# Altium project P9XV1.0.PrjPCB (part 2 of 2)
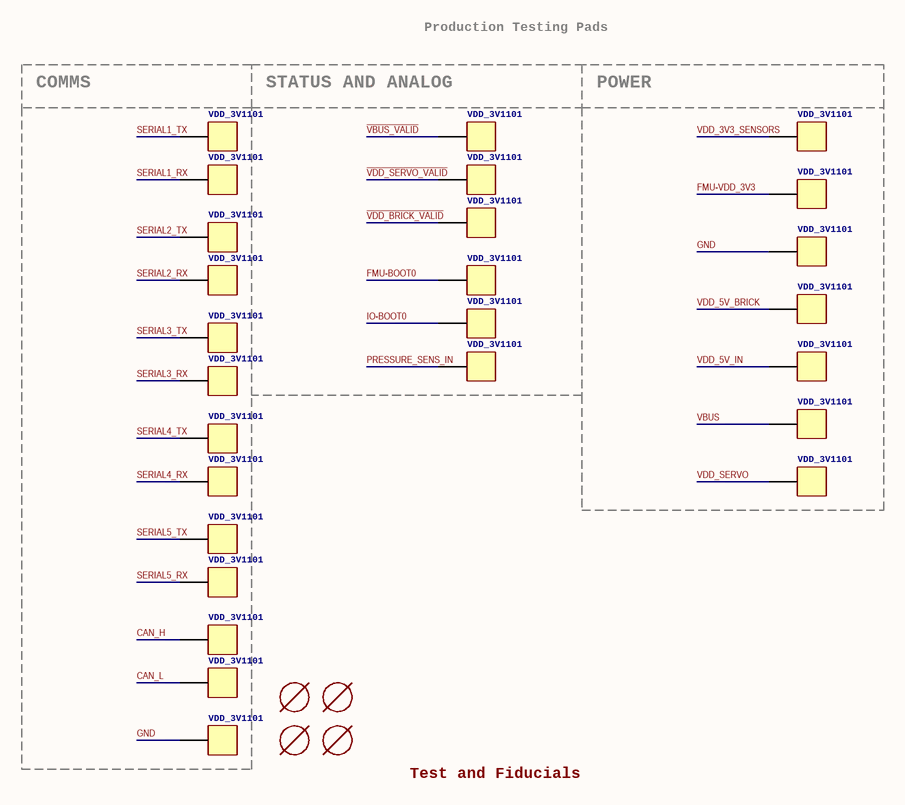
[diagram p10: Test and Fiducials.SchDoc]

## Nets that join several sheets
GND: F217Soc (24 pins), FMU IO ports (29 pins), IMU (J501.7 J501.14 U501.7 U501.8), F427&IMU Power Supply (19 pins), LEDs etc (11 pins), F100SoC (15 pins), Servo interface (24 pins), IO Power Supply (9 pins), Power SUM (20 pins), Test and Fiducials (GND.P$1 GND..P$1)
~{ACCEL_MAG_CS}: F217Soc (U101.9), IMU (J501.2 U501.2)
ACCEL_DRDY: F217Soc (U101.90), IMU (J501.4 U501.4)
ALARM: F217Soc (U101.77), LEDs etc (C705.P$2 Q701.2 R706.P$2)
~{BARO_CS}: F217Soc (U101.88), IMU (J501.10 U501.11)
BATT_CURRENT_SENS: F217Soc (U101.26), Power SUM (R1101.P$1)
BATT_VOLTAGE_SENS: F217Soc (U101.25), Power SUM (R1102.P$1)
CAN1_RX: F217Soc (U101.81), FMU IO ports (U401.4)
CAN1_TX: F217Soc (U101.82), FMU IO ports (U401.1)
CAN2_RX: F217Soc (U101.51), FMU IO ports (R216.1)
CAN2_TX: F217Soc (U101.92), FMU IO ports (R215.1)
CAN_H: FMU IO ports (J405.2 R409.P$1 U401.7), Test and Fiducials (CAN_H.P$1)
CAN_L: FMU IO ports (J405.3 R409.P$2 U401.6), Test and Fiducials (CAN_L.P$1)
~{FMU-LED_AMBER}: F217Soc (U101.43), LEDs etc (R707.P$1)
FMU-BOOT0: F217Soc (R611.1 U101.94), Test and Fiducials (FMU-BOOT1101.P$1)
FMU-CH1: F217Soc (U101.45), Servo interface (U901.7)
FMU-CH2: F217Soc (U101.44), Servo interface (U901.6)
FMU-CH3: F217Soc (U101.42), Servo interface (U901.5)
FMU-CH4: F217Soc (U101.40), Servo interface (U901.4)
FMU-CH5: F217Soc (U101.60), Servo interface (U901.3)
FMU-CH6: F217Soc (U101.61), Servo interface (U901.2)
FMU-I2C1_SCL: F217Soc (U101.95), FMU IO ports (R401.P$1 R404.P$1)
FMU-I2C1_SDA: F217Soc (U101.96), FMU IO ports (R402.P$1 R405.P$1)
FMU-I2C2_SCL: F217Soc (U101.47), FMU IO ports (R306.P$1), LEDs etc (U701.3)
FMU-I2C2_SDA: F217Soc (U101.48), FMU IO ports (R307.P$1), LEDs etc (U701.2)
FMU-~{RESET}: F427&IMU Power Supply (U603.1), LEDs etc (U701.4)
FMU-SWCLK: F217Soc (U101.76), FMU IO ports (JX301.3)
FMU-SWDIO: F217Soc (U101.72), FMU IO ports (JX301.2)
FMU-SWO: F217Soc (U101.89), FMU IO ports (JX301.4)
FMU-UART4_RX: F217Soc (U101.24), FMU IO ports (U202.16)
FMU-UART4_TX: F217Soc (U101.23), FMU IO ports (U202.5)
FMU-UART7_RX: F217Soc (U101.38), FMU IO ports (U202.14)
FMU-UART7_TX: F217Soc (U101.39), FMU IO ports (U202.7)
FMU-UART8_RX: F217Soc (U101.97), FMU IO ports (U202.12)
FMU-UART8_TX: F217Soc (U101.98), FMU IO ports (U202.9)
FMU-USART2_CTS: F217Soc (U101.84), FMU IO ports (U201.7)
FMU-USART2_RTS: F217Soc (U101.85), FMU IO ports (U201.6)
FMU-USART2_RX: F217Soc (U101.87), FMU IO ports (U201.12)
FMU-USART2_TX: F217Soc (U101.86), FMU IO ports (U201.9)
FMU-USART3_CTS: F217Soc (U101.58), FMU IO ports (U201.3)
FMU-USART3_RTS: F217Soc (U101.59), FMU IO ports (U201.2)
FMU-USART3_RX: F217Soc (U101.56), FMU IO ports (U201.16)
FMU-USART3_TX: F217Soc (U101.55), FMU IO ports (U201.5)
FMU-VDD_3V3: F217Soc (20 pins), FMU IO ports (19 pins), F427&IMU Power Supply (5 pins), LEDs etc (C701.P$1 U701.1 U701.10), Servo interface (C902.P$1 U901.1 U901.20), Power SUM (C1105.P$1), Test and Fiducials (VDD_3V1101.P$1)
FMU-VDD_5V5: F217Soc (R609.2), F427&IMU Power Supply (8 pins), LEDs etc (10 pins), IO Power Supply (F1001.1), Power SUM (C1104.P$1 D1101.C D1102.C D1103.C), Test and Fiducials (VDD_5V_IN.P$1)
FMU_AUX_ADC1: F217Soc (U101.18), FMU IO ports (R408.P$1)
FMU_AUX_ADC2: F217Soc (U101.33), FMU IO ports (R407.P$1)
~{GYRO_CS}: F217Soc (U101.7), IMU (J501.5 U501.5)
GPIO_EXT_1: F217Soc (U101.8), FMU IO ports (J403.6)
GYRO_DRDY: F217Soc (U101.35), IMU (J501.6 U501.6)
~{IO-LED_AMBER}: LEDs etc (R709.P$1), F100SoC (U801.27)
~{IO-LED_BLUE}: LEDs etc (R712.P$1), F100SoC (U801.28)
~{IO-LED_SAFETY}: LEDs etc (R710.P$2), F100SoC (U801.26)
IO-BOOT0: F100SoC (R801.P$2 U801.44), Test and Fiducials (IO-BOOT1101.P$1)
IO-CH1: F100SoC (U801.10), Servo interface (U902.9)
IO-CH2: F100SoC (U801.11), Servo interface (U902.8)
IO-CH3: F100SoC (U801.45), Servo interface (U902.7)
IO-CH4: F100SoC (U801.46), Servo interface (U902.6)
IO-CH5: F100SoC (U801.16), Servo interface (U902.5)
IO-CH6: F100SoC (U801.17), Servo interface (U902.4)
IO-CH7: F100SoC (U801.18), Servo interface (U902.3)
IO-CH8: F100SoC (U801.19), Servo interface (U902.2)
IO-~{RESET}: F100SoC (C801.P$2 S?.1 U801.7), IO Power Supply (U1002.1)
IO-USART1_TX: F217Soc (R101.1), F100SoC (JX801.1 U801.30)
IO-~{VDD_SERVO_IN_FAULT}: F100SoC (U801.38), IO Power Supply (R1001.P$1 R1002.P$2)
IO-VDD_3V3: LEDs etc (JP201.27), F100SoC (8 pins), Servo interface (5 pins), IO Power Supply (C1003.P$1 C1004.P$1 U1001.5 U1002.3)
IO-VDD_5V5: LEDs etc (LED702.A LED703.3 LED703.4), Servo interface (JP901.3 JP901.4), IO Power Supply (6 pins)
~{MPU_CS}: F217Soc (U101.17), IMU (J501.9 U501.10)
MAG_DRDY: F217Soc (U101.36), IMU (J501.3 U501.3)
MPU_DRDY: F217Soc (U101.62), IMU (J501.8 U501.9)
OTG_FS_DM: F217Soc (U101.70), FMU IO ports (U302.3)
OTG_FS_DP: F217Soc (U101.71), FMU IO ports (U302.1)
PPM_INPUT: F100SoC (U801.29), Servo interface (D901.C R909.P$1 U903.2)
PRESSURE_SENS: F217Soc (U101.34), FMU IO ports (C401.P$1 R403.P$2 R406.P$1)
PRESSURE_SENS_IN: FMU IO ports (JP201.36 R406.P$2), Test and Fiducials (ADC_PR.P$1)
RSSI_IN: F100SoC (U801.15 U801.33), Servo interface (R901.P$1)
~{SBUS_OUTPUT_EN}: F100SoC (U801.40), Servo interface (U903.7)
~{SPI_EXT_NSS}: F217Soc (U101.3), FMU IO ports (J403.5)
SAFETY: LEDs etc (JP201.29), F100SoC (U801.41)
SBUS_INPUT: F100SoC (U801.22), Servo interface (U903.6)
SBUS_OUTPUT: F100SoC (U801.21), Servo interface (U903.5)
SDIO_CK: F217Soc (U101.80), FMU IO ports (U301.5)
SDIO_CMD: F217Soc (U101.83), FMU IO ports (R303.P$1 U301.3)
SDIO_D0: F217Soc (U101.65), FMU IO ports (R304.P$1 U301.7)
SDIO_D1: F217Soc (U101.66), FMU IO ports (R305.P$1 U301.8)
SDIO_D2: F217Soc (U101.78), FMU IO ports (R301.P$1 U301.1)
SDIO_D3: F217Soc (U101.79), FMU IO ports (R302.P$1 U301.2)
SERIAL1_RX: FMU IO ports (JP201.6 RN202C.1), Test and Fiducials (S1RX.P$1)
SERIAL1_TX: FMU IO ports (JP201.5 RN202D.1), Test and Fiducials (S1TX.P$1)
SERIAL2_RX: FMU IO ports (JP201.12 RN201C.1), Test and Fiducials (S2RX.P$1)
SERIAL2_TX: FMU IO ports (JP201.11 RN201D.1), Test and Fiducials (S2TX.P$1)
SERIAL3_RX: FMU IO ports (JP201.20 RN203C.1), Test and Fiducials (S3RX.P$1)
SERIAL3_TX: FMU IO ports (JP201.19 RN203D.1), Test and Fiducials (S3TX.P$1)
SERIAL4_RX: FMU IO ports (JP201.16 RN204C.1), Test and Fiducials (S4RX.P$1)
SERIAL4_TX: FMU IO ports (JP201.15 RN204D.1), Test and Fiducials (S4TX.P$1)
SERIAL5_RX: FMU IO ports (JP201.18 RN204A.1), Test and Fiducials (S5_RX.P$1)
SERIAL5_TX: FMU IO ports (JP201.17 RN204B.1), Test and Fiducials (S5_TX.P$1)
SERIAL_FMU_TO_IO: F217Soc (U101.63), F100SoC (R804.P$1)
SERIAL_IO_TO_FMU: F217Soc (U101.64), F100SoC (R803.P$1)
SPI_EXT_MISO: F217Soc (U101.4), FMU IO ports (J403.3)
SPI_EXT_MOSI: F217Soc (U101.5), FMU IO ports (J403.4)
SPI_EXT_SCK: F217Soc (U101.1), FMU IO ports (J403.2)
SPI_INT_MISO: F217Soc (U101.31), IMU (J501.11 U501.12)
SPI_INT_MOSI: F217Soc (U101.32), IMU (J501.12 U501.13)
SPI_INT_SCK: F217Soc (U101.30), IMU (J501.13 U501.14)
~{VBUS_VALID}: F217Soc (U101.15), Test and Fiducials (!VBUS_VALID.P$1)
~{VDD_5V_HIPOWER_OC}: F217Soc (U101.41), F427&IMU Power Supply (R602.P$1 R617.P$1)
~{VDD_5V_PERIPH_OC}: F217Soc (U101.46), F427&IMU Power Supply (R604.P$1 R616.P$1)
~{VDD_BRICK_VALID}: F217Soc (U101.91), Test and Fiducials (!VDD_BRICK_VALID.P$1)
~{VDD_SERVO_VALID}: F217Soc (U101.93), Test and Fiducials (!VDD_SERVO_VALID.P$1)
VBAT: F217Soc (B601.1 R608.1 U101.6), F100SoC (U801.1)
VBUS: F217Soc (U101.68), FMU IO ports (J301.1 JP201.33 JP201.34 U302.5), Test and Fiducials (VBUS.P$1)
VDD_3V3_SENSORS: IMU (J501.1 U501.1), F427&IMU Power Supply (C605.P$1 C617.P$1 Q601.E U602.5), Test and Fiducials (VDDA_3V1101.P$1)
VDD_3V3_SENSORS_EN: F217Soc (U101.2), F427&IMU Power Supply (R603.P$2 R620.P$2 U602.3)
VDD_5V_BRICK: Power SUM (8 pins), Test and Fiducials (VDD_5V_BRICK.P$1)
VDD_5V_HIPOWER: FMU IO ports (5 pins), F427&IMU Power Supply (C614.P$1 D603.C F601.2 R602.P$2)
VDD_5V_PERIPH: FMU IO ports (9 pins), F427&IMU Power Supply (C618.P$1 D604.C F602.2 R604.P$2)
VDD_SERVO: Servo interface (6 pins), Power SUM (C1102.P$1 F1102.1), Test and Fiducials (VDD_SERVO.P$1)
VDD_SERVO_IN: Servo interface (C904.P$1 D903.C D904.C), IO Power Supply (F1002.1)
VDD_SERVO_SENS: F100SoC (U801.14), Servo interface (R918.P$1 R919.P$2)